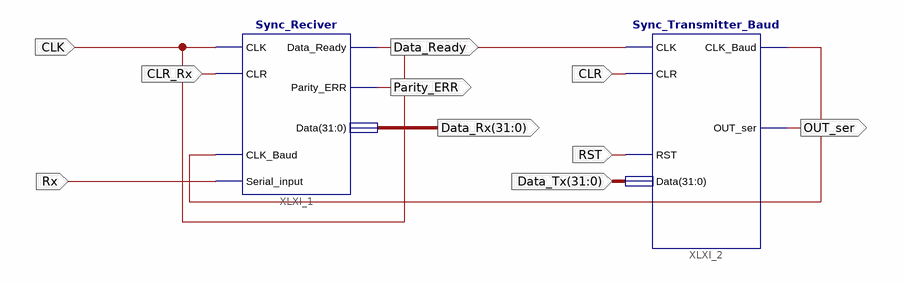
[diagram p0: schematic sheet 1]
// Xilinx ISE schematic TESTUART.sch (spartan6) as structural Verilog: 2 symbols, 10 ports
module TESTUART (
  input  CLK,
  input  CLR_Rx,
  input  CLR,
  input  Rx,
  input  [31:0] Data_Tx,
  input  RST,
  output OUT_ser,
  output [31:0] Data_Rx,
  output Data_Ready,
  output Parity_ERR
);

  wire XLXN_2;

  Sync_Reciver XLXI_1 (
    .CLK(CLK), .CLR(CLR_Rx), .CLK_Baud(XLXN_2), .Serial_input(Rx), .Data_Ready(Data_Ready),
    .Parity_ERR(Parity_ERR), .Data(Data_Rx));
  Sync_Transmitter_Baud XLXI_2 (.CLK(CLK), .CLR(CLR), .RST(RST), .Data(Data_Tx), .CLK_Baud(XLXN_2), .OUT_ser(OUT_ser));
endmodule
